# Altium project LM-008.PrjPcb
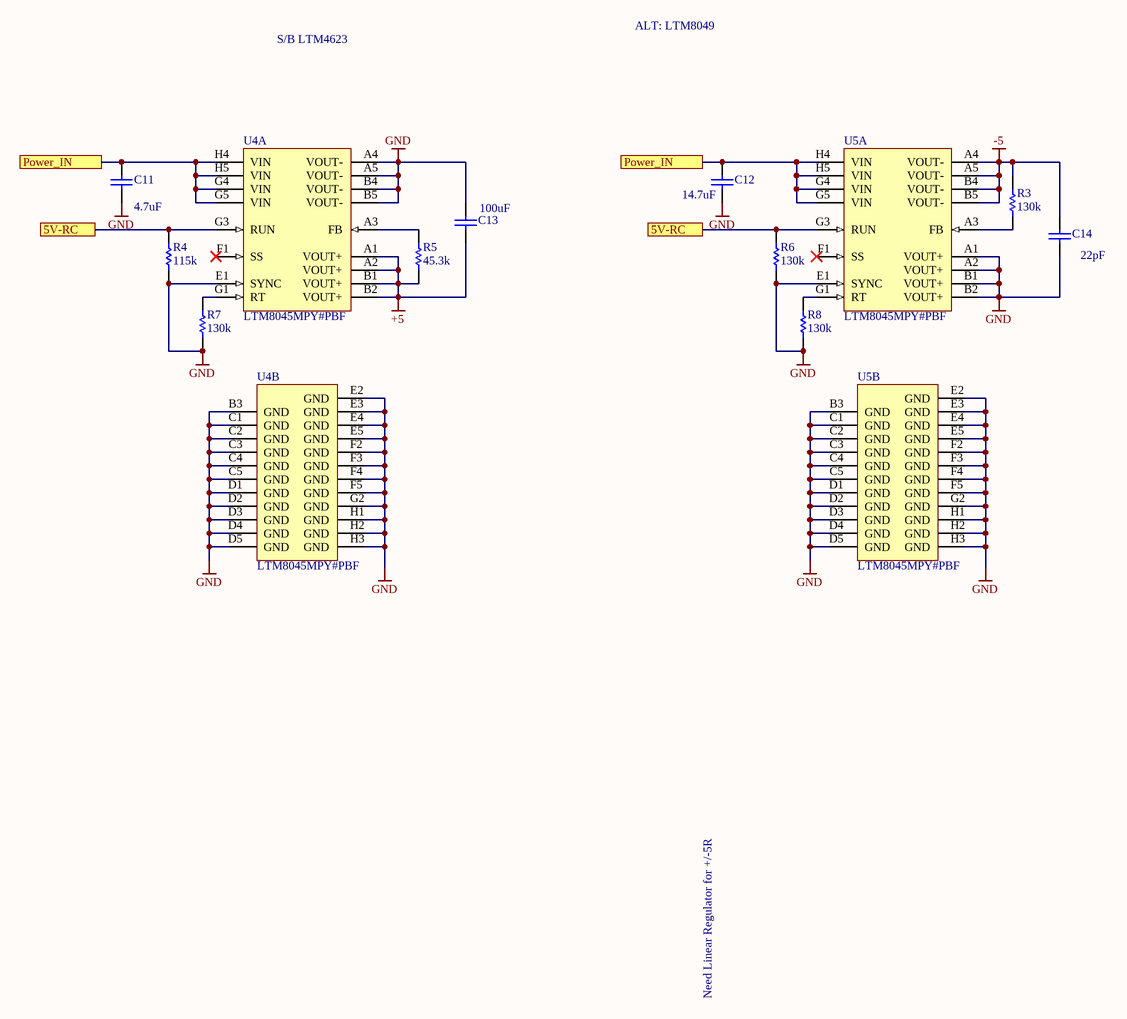
[diagram p0: 5R_Supply.SchDoc]
4 sheets, 51 parts. Net scope: flat (ports and power ports of the same name join across sheets).
Board file: LM-008.PcbDoc
Sheets:
  5R_Supply.SchDoc
  Power_Input_FET.SchDoc
  BBB-Supply.SchDoc
  ADC.SchDoc

## Sheet 5R_Supply.SchDoc
size Tabloid

### Parts
(Parts that share a designator on the sheet are numbered #1, #2 ... from top to bottom, then left to right.)
C11#1  value 4.7uF  [CAPC1206(3216)110_N]
C12  Capacitance: 14.7uF  [CAPC1206(3216)130_N]  (hidden comment: CAP CER 10UF 6.3V X5R 1206)
C13#1  value 100uF  [CAPC1210(3225)100_N]
C14#1  Capacitance: 22pF  [CAPC1206(3216)130_N]  (hidden comment: CAP CER 10UF 6.3V X5R 1206)
R3#1  Resistance (Ohms): 130k  [RESC0805(2012)_M]  (hidden comment: RES SMD 43K OHM 1% 1/8W 0805)
R4  Resistance (Ohms): 115k  [RESC0805(2012)_M]  (hidden comment: RES SMD 43K OHM 1% 1/8W 0805)
R5#1  Resistance (Ohms): 45.3k  [RESC0805(2012)_M]
R6#1  Resistance (Ohms): 130k  [RESC0805(2012)_M]  (hidden comment: RES SMD 43K OHM 1% 1/8W 0805)
R7  Resistance (Ohms): 130k  [RESC0805(2012)_M]  (hidden comment: RES SMD 43K OHM 1% 1/8W 0805)
R8  Resistance (Ohms): 130k  [RESC0805(2012)_M]  (hidden comment: RES SMD 43K OHM 1% 1/8W 0805)
U4  LTM8045MPY#PBF  [LT-BGA-40-11250X6250X4920]  (parts A,B of 2)
U5  LTM8045MPY#PBF  [LT-BGA-40-11250X6250X4920]  (parts A,B of 2)

### Ports
5V-RC, Power_IN

### Nets
+5: C13#1.1 R5#1.1 U4.A1(VOUT+) U4.A2(VOUT+) U4.B1(VOUT+) U4.B2(VOUT+)
-5: C14#1.2 R3#1.2 U5.A4(VOUT-) U5.A5(VOUT-) U5.B4(VOUT-) U5.B5(VOUT-)
GND: C11#1.1 C12.1 C13#1.2 C14#1.1 R4.1 R6#1.1 R7.1 R8.1 U4.A4(VOUT-) U4.A5(VOUT-) U4.B3(GND) U4.B4(VOUT-) U4.B5(VOUT-) U4.C1(GND) U4.C2(GND) U4.C3(GND) U4.C4(GND) U4.C5(GND) U4.D1(GND) U4.D2(GND) U4.D3(GND) U4.D4(GND) U4.D5(GND) U4.E1(SYNC) U4.E2(GND) U4.E3(GND) U4.E4(GND) U4.E5(GND) U4.F2(GND) U4.F3(GND) U4.F4(GND) U4.F5(GND) U4.G2(GND) U4.H1(GND) U4.H2(GND) U4.H3(GND) U5.A1(VOUT+) U5.A2(VOUT+) U5.B1(VOUT+) U5.B2(VOUT+) U5.B3(GND) U5.C1(GND) U5.C2(GND) U5.C3(GND) U5.C4(GND) U5.C5(GND) U5.D1(GND) U5.D2(GND) U5.D3(GND) U5.D4(GND) U5.D5(GND) U5.E1(SYNC) U5.E2(GND) U5.E3(GND) U5.E4(GND) U5.E5(GND) U5.F2(GND) U5.F3(GND) U5.F4(GND) U5.F5(GND) U5.G2(GND) U5.H1(GND) U5.H2(GND) U5.H3(GND)
Power_IN: C11#1.2 C12.2 U4.G4(VIN) U4.G5(VIN) U4.H4(VIN) U4.H5(VIN) U5.G4(VIN) U5.G5(VIN) U5.H4(VIN) U5.H5(VIN) ; port Power_IN
NetR3#1_1: R3#1.1 U5.A3(FB)
NetR4_2: R4.2 R6#1.2 U4.G3(RUN) U5.G3(RUN) ; port 5V-RC
NetR5#1_2: R5#1.2 U4.A3(FB)
NetR7_2: R7.2 U4.G1(RT)
NetR8_2: R8.2 U5.G1(RT)

Not connected (* = marked no-connect by the designer): U4 F1(SS)*; U5 F1(SS)*

### Notes on the sheet
- S/B LTM4623
- ALT: LTM8049
- Need Linear Regulator for +/-5R
- Title
- Size:
- Date:
- Tabloid
- Number:
- Time:
- Revision:
- Sheet
- of
- ZLS Corporation
- 7801 North Lamar Blvd.
- Suite E-184
- Austin, Texas 78752  USA
- (512) 453-0288
- File:

### Library data of the parts
C11#1 = CMP-1037-04332-1
C12 C14#1 = CMP-1037-04913-1: Manufacturer: Taiyo Yuden; Manufacturer Part Number: JMK316BJ106ML-T; Tolerance: ±20%; Notification: Current market demand for these product types have resulted in fluctuating and extending lead times. Lead times may differ.; Supplier 1: Digi-Key; Supplier Part Number 1: 587-5447-1-ND; RoHS: RoHS Compliant; Category: Capacitors; Stock 1: 5600; Pricing 1: 1=0.24, 10=0.161, 100=0.0817, 500=0.05592, 1000=0.04946 (USD); Packaging: Cut Tape (CT); Part Status: Active; Voltage - Rated: 6.3V; Temperature Coefficient: X5R; Operating Temperature: -55°C ~ 85°C; Features: -; Ratings: -; Applications: SMPS Filtering; Failure Rate: -; Mounting Type: Surface Mount, MLCC; Package / Case: 1206 (3216 Metric); Size / Dimension: 0.126" L x 0.063" W (3.20mm x 1.60mm); Height - Seated (Max): -; Thickness (Max): 0.071" (1.80mm); Lead Spacing: -; Lead Style: -; ComponentLink1URL: http://ds.yuden.co.jp/TYCOMPAS/ut/detail.do?productNo=JMK316BJ106ML-T&fileName=JMK316BJ106ML-T_SS&mode=specSheetDownload; ComponentLink1Description: http://ds.yuden.co.jp/TYCOMPAS/ut/detail.do?productNo=JMK316BJ106ML-T&fileName=JMK316BJ106ML-T_SS&mode=specSheetDownload
C13#1 = CMP-1038-01331-1
R3#1 R4 R6#1 R7 R8 = CMP-1013-00017-1: RES SMD 10K OHM 1% 1/8W 0805
R5#1 = CMP-1013-00017-1
U4 U5 = CMP-0483-00032-1: Inverting or SEPIC uModule DC/DC Converter with Up to 700 mA Output Current, 40-pin BGA, -55 to 125 degC, Pb-Free, Tray; Manufacturer: Linear Technology; Synchronous: no; Isupply(mA): 10; Frequency Sync Range: 200kHz - 2MHz; Number of Outputs: 1; Vin Min(V): 2.8; Switch Current(A): 3; Vin Max(V): 18; Topology: Sepic, Inverting; Extended Temp: E, I, MP; Frequency(kHz): 2000; PackageDescription: 40-Ball BGA, Body 11.25 x 6.25 mm, Pitch 1.27 mm; PartNumber: LTM8045MPY#PBF; Ishutdown(uA): 1; Frequency Adjust Range: 200kHz - 2MHz; PackageReference: BGA-40; Packing: Tray; DatasheetVersion: Rev. A; Vout Max(V): 18; ComponentLink1URL: http://www.linear.com/; Code_JEDEC: MS-028; Vswitch Max(V): 18; Tracking: no; RoHS: TRUE; Mounting Technology: Surface Mount; ComponentLink3Description: Package Specification; ComponentLink3URL: http://cds.linear.com/docs/en/packaging/BGA_40_05-08-1867.pdf; ComponentLink2Description: Datasheet; PackageVersion: Rev. Ã˜, 08/2010; ComponentLink1Description: Manufacturer URL; ComponentLink2URL: http://cds.linear.com/docs/en/datasheet/8045fa.pdf; PartId: 1

## Sheet Power_Input_FET.SchDoc: Power Input
size OrCAD A; CompanyName: ZLS; DocumentNumber: LM-008; Revision: F
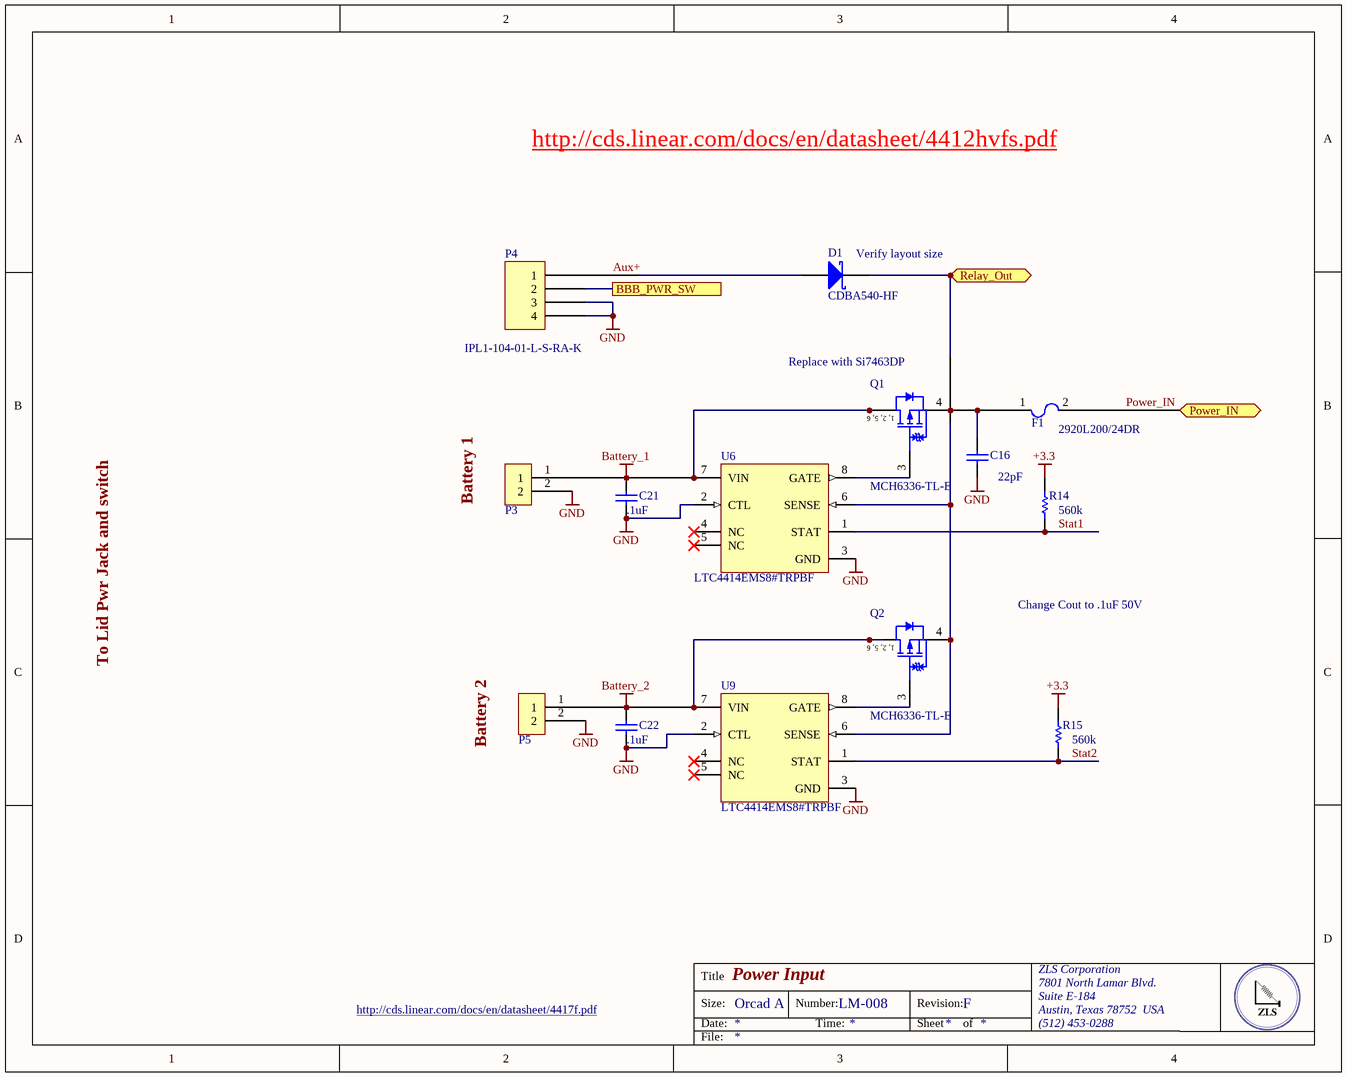
[diagram p1: Power_Input_FET.SchDoc]

### Parts
C16  Capacitance: 22pF  [CAPC1206(3216)130_N]  (hidden comment: CAP CER 10UF 6.3V X5R 1206)
C21  Capacitance: .1uF  [CAPC1206(3216)130_N]  (hidden comment: CAP CER 10UF 6.3V X5R 1206)
C22  Capacitance: .1uF  [CAPC1206(3216)130_N]  (hidden comment: CAP CER 10UF 6.3V X5R 1206)
D1  CDBA540-HF  [VISH-DO-214AC-2_M]
F1  PCT  [CAPC7451X12N]  (value not drawn)
P3  IPL1-102-01-F-S-RA-K  [IPL1-102-01-F-S-RA-K]  (value not drawn)
P4  IPL1-104-01-L-S-RA-K  [IPL1-104-01-L-S-RA-K]
P5  IPL1-102-01-F-S-RA-K  [IPL1-102-01-F-S-RA-K]  (value not drawn)
Q1  MCH6336-TL-E  [ONSC-MCPH-6_V]
Q2  MCH6336-TL-E  [ONSC-MCPH-6_V]
R14  560k  [RESC0402(1005)_L]
R15  560k  [RESC0402(1005)_L]
U6  LTC4414EMS8#TRPBF  [LT-MS8-8_L]
U9  LTC4414EMS8#TRPBF  [LT-MS8-8_L]

### Ports
BBB_PWR_SW, Power_IN, Relay_Out

### Nets
+3.3: R14.2 R15.2
Battery_1: C21.2 P3.1 Q1.1(D) Q1.2(D) Q1.5(D) Q1.6(D) U6.7(VIN)
Battery_2: C22.2 P5.1 Q2.1(D) Q2.2(D) Q2.5(D) Q2.6(D) U9.7(VIN)
GND: C16.1 C21.1 C22.1 P3.2 P4.3 P4.4 P5.2 U6.2(CTL) U6.3(GND) U9.2(CTL) U9.3(GND)
Aux+: D1.1(A) P4.1
Power_IN: F1.2 ; port Power_IN
Stat1: R14.1 U6.1(STAT)
Stat2: R15.1 U9.1(STAT)
NetC16_2: C16.2 D1.2(K) F1.1 Q1.4(S) Q2.4(S) U6.6(SENSE) U9.6(SENSE) ; port Relay_Out
NetP4_2: P4.2 ; port BBB_PWR_SW
NetQ1_3: Q1.3(G) U6.8(GATE)
NetQ2_3: Q2.3(G) U9.8(GATE)

Not connected (* = marked no-connect by the designer): U6 4(NC)* 5(NC)*; U9 4(NC)* 5(NC)*

### Notes on the sheet
- http://cds.linear.com/docs/en/datasheet/4412hvfs.pdf
- (near D1) Verify layout size
- (near Q1) Replace with Si7463DP
- (near F1) 2920L200/24DR
- Battery 1
- Change Cout to .1uF 50V
- To Lid Pwr Jack and switch
- Battery 2
- http://cds.linear.com/docs/en/datasheet/4417f.pdf
- Title
- Size:
- Date:
- Orcad A
- Number:
- Time:
- Revision:
- Sheet
- of
- ZLS Corporation
- 7801 North Lamar Blvd.
- Suite E-184
- Austin, Texas 78752  USA
- (512) 453-0288
- File:
- (in symbol CMP-1058-00598-1) 1, 2, 5, 6

### Library data of the parts
C16 C21 C22 = CMP-1037-04913-1: as C12 on sheet 5R_Supply; Supplier 1: Digi-Key; Supplier Part Number 1: 587-5447-1-ND; RoHS: RoHS Compliant; Category: Capacitors; Stock 1: 5600; Pricing 1: 1=0.24, 10=0.161, 100=0.0817, 500=0.05592, 1000=0.04946 (USD); Packaging: Cut Tape (CT); Part Status: Active; Voltage - Rated: 6.3V; Temperature Coefficient: X5R; Operating Temperature: -55°C ~ 85°C; Features: -; Ratings: -; Applications: SMPS Filtering; Failure Rate: -; Mounting Type: Surface Mount, MLCC; Package / Case: 1206 (3216 Metric); Size / Dimension: 0.126" L x 0.063" W (3.20mm x 1.60mm); Height - Seated (Max): -; Thickness (Max): 0.071" (1.80mm); Lead Spacing: -; Lead Style: -; ComponentLink1URL: http://ds.yuden.co.jp/TYCOMPAS/ut/detail.do?productNo=JMK316BJ106ML-T&fileName=JMK316BJ106ML-T_SS&mode=specSheetDownload; ComponentLink1Description: http://ds.yuden.co.jp/TYCOMPAS/ut/detail.do?productNo=JMK316BJ106ML-T&fileName=JMK316BJ106ML-T_SS&mode=specSheetDownload
D1 = D Schottky: DIODE SCHOTTKY 40V 5A DO214AB; Manufacturer: Comchip Technology; Speed: Fast Recovery =< 500ns, > 200mA (Io); Capacitance @ Vr, F: 380pF @ 4V, 1MHz; Supplier 1: Digi-Key; Supplier Part Number 1: 641-1707-6-ND; Manufacturer Part Number: CDBA540-HF; RoHS: RoHS Compliant; Category: Discrete Semiconductor Products; Stock 1: 7367; Pricing 1: 1=0.49, 10=0.381, 25=0.3208, 100=0.2612, 250=0.2164, 500=0.1791, 1000=0.13432, 2500=0.12313 (USD); Packaging: Digi-Reel®; Part Status: Active; Diode Type: Schottky; Current - Average Rectified (Io): 5A; Mounting Type: Surface Mount; Package / Case: DO-214AC, SMA; Supplier Device Package: DO-214AC (SMA); Operating Temperature - Junction: -50°C ~ 150°C; ComponentLink1URL: http://www.comchiptech.com/cms/UserFiles/CDBA540-HF%20Thru505315.%20CDBA5200-HF%20RevC.pdf; ComponentLink1Description: http://www.comchiptech.com/cms/UserFiles/CDBA540-HF%20Thru505315.%20CDBA5200-HF%20RevC.pdf
P4 = IPL1-104-01-L-S-RA-K: Manufacturer: Samtec Inc.; Connector Type: Header; Pitch - Mating: 0.100" (2.54mm); Number of Positions: 4; Number of Positions Loaded: All; Style: Board to Cable/Wire; Shrouding: Shrouded - 4 Wall; Contact Length - Mating: 0.215" (5.46mm); Contact Length - Post: 0.085" (2.16mm); Material Flammability Rating: UL94 V-0; Voltage Rating: 675VAC, 954VDC; Supplier 1: Digi-Key; Supplier Part Number 1: SAM9597-ND; Manufacturer Part Number: IPL1-104-01-L-S-RA-K; RoHS: RoHS Compliant; Category: Connectors, Interconnects; Stock 1: 265; Pricing 1: 1=2.53, 10=2.424, 100=2.02, 500=1.717, 1000=1.4645, 5000=1.313 (USD); Packaging: Tube; Part Status: Active; Contact Type: Male Pin; Number of Rows: 1; Row Spacing - Mating: -; Mounting Type: Through Hole, Right Angle; Termination: Solder; Fastening Type: Locking Ramp; Overall Contact Length: -; Insulation Height: 0.240" (6.10mm); Contact Shape: Square; Contact Finish - Mating: Gold; Contact Finish Thickness - Mating: 10µin (0.25µm); Contact Finish - Post: Tin; Contact Material: Phosphor Bronze; Insulation Material: Liquid Crystal Polymer (LCP); Features: -; Operating Temperature: -55°C ~ 125°C; Ingress Protection: -; Insulation Color: Natural; Current Rating: -; Mated Stacking Heights: -; Contact Finish Thickness - Post: -; Applications: -; ComponentLink1URL: http://suddendocs.samtec.com/prints/ipl1-1xx-xx-xxx-s-xx-x-xx-mkt.pdf; ComponentLink1Description: http://suddendocs.samtec.com/prints/ipl1-1xx-xx-xxx-s-xx-x-xx-mkt.pdf
Q1 Q2 = CMP-1058-00598-1: P-Channel Power MOSFET, -12 V, -5 A, 43 mOhm, Single, 6-Pin MCPH, Pb-Free, Tape and Reel; Manufacturer: On Semiconductor; Channel Polarity: P Channel; VGS(th) Max (V): 1.4; Ciss Typ (pF): 660; V(BR)DSS Min (V): 12; VGS Max (V): 10; Crss Typ (pF): 155; Coss Typ (pF): 210; PD Max (W): 1.5; ID Max (A): 5; Package Type: SC-88FL / MCPH-6; ComponentLink2URL: http://www.onsemi.cn/pub_link/Collateral/MCH6336-D.PDF; ComponentLink3URL: http://www.onsemi.com/pub_link/Collateral/ENA1601-D.PDF; RoHS: Pb-Free; Mounting Technology: Surface Mount; PartNumber: MCH6336-TL-E; ComponentLink2Description: Datasheet; ComponentLink1URL: http://www.onsemi.com/; ComponentLink1Description: Manufacturer URL; Configuration: Single; ComponentLink3Description: Package Specification; Packing: Tape and Reel; PackageDescription: 6-Pin Small Outline Transistor, Body 2 x 1.6 mm, Pitch 0.65 mm; PackageReference: MCPH-6
R14 R15 = CMP-1011-00927-1: Tolerance: ±1%; Temperature Coefficient: ±100ppm/°C; Supplier Part Number 1: YAG3220CT-ND; Supplier Device Package: 0402
U6 U9 = CMP-0479-00214-1: Low Loss PowerPath Controller for Large PFET, 3 to 36 V Vin, 8-pin SOP (MS8-8), -40 to 85 degC, Pb-Free, Tape and Reel; Manufacturer: Linear Technology; Ideal Diode: Single, External, P-Channel; ComponentLink3URL: http://cds.linear.com/docs/en/packaging/05081660_G_MS8.pdf; DatasheetVersion: Rev. C; ComponentLink2Description: Datasheet; ComponentLink1Description: Manufacturer URL; ComponentLink2URL: http://cds.linear.com/docs/en/datasheet/4414fc.pdf; ComponentLink3Description: Package Specification; ComponentLink1URL: http://www.linear.com/; Packing: Tape and Reel; Mounting Technology: Surface Mount; PackageDescription: 8-Pin Plastic MSOP, Body 3 x 3 mm, Pitch 0.65 mm; PackageVersion: Rev. G, 03/2012; PackageReference: MS8-8; PartNumber: LTC4414EMS8#TRPBF; RoHS: TRUE

## Sheet BBB-Supply.SchDoc
size OrCAD A
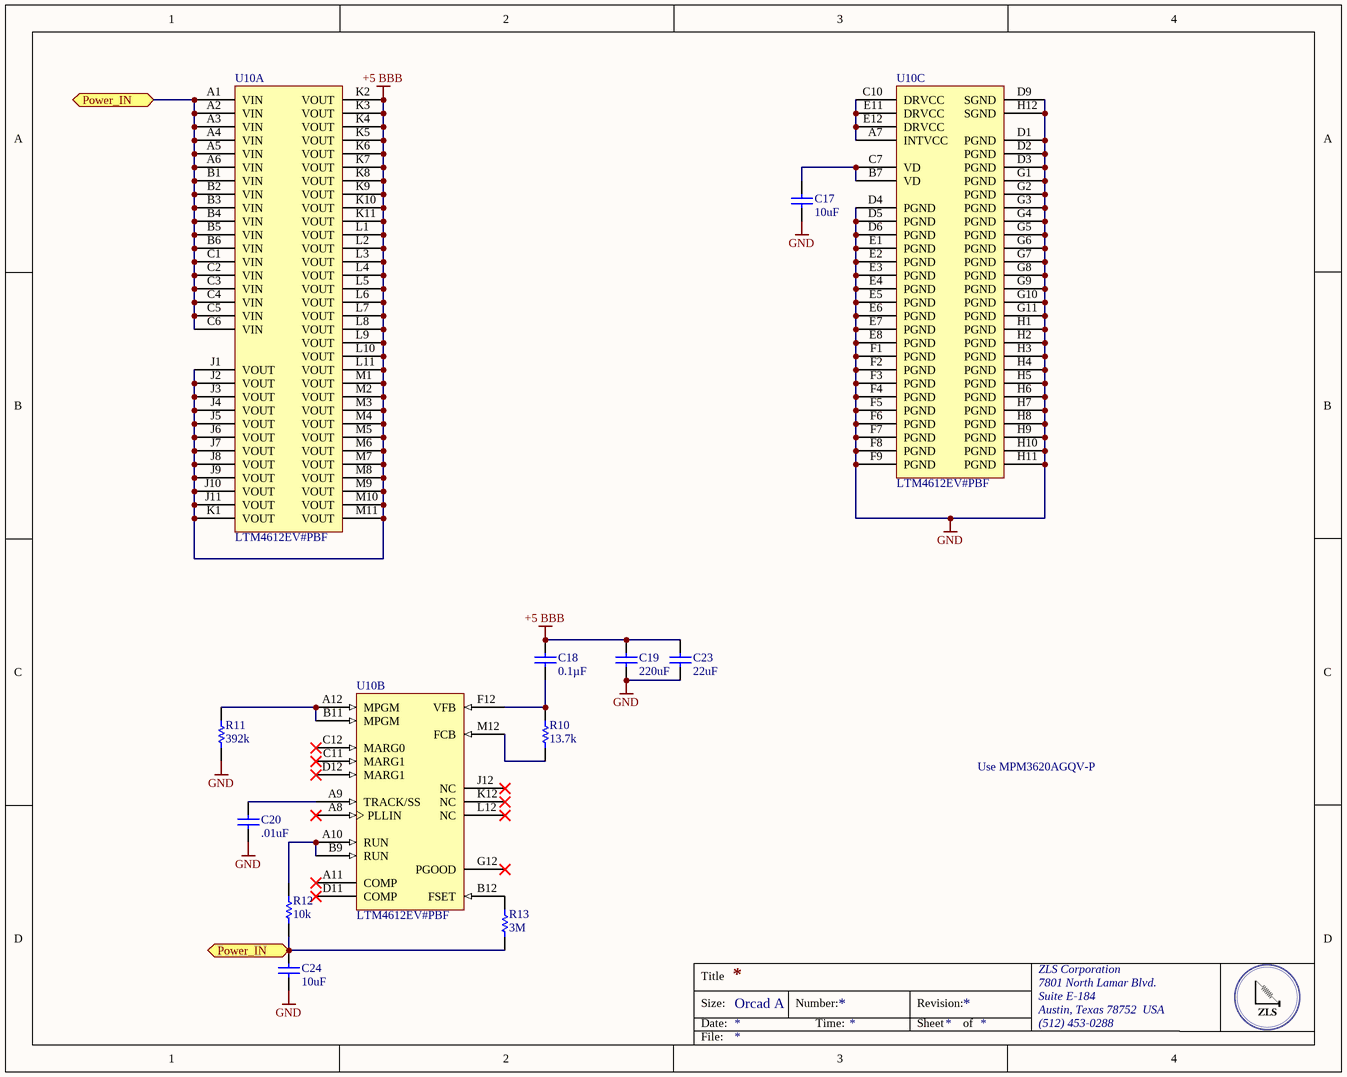
[diagram p2: BBB-Supply.SchDoc]

### Parts
(Parts that share a designator on the sheet are numbered #1, #2 ... from top to bottom, then left to right.)
C17  Capacitance: 10uF  [CAPC0805(2012)145_N]  (hidden comment: CAP CER 0.1UF 16V X7R 0805)
C18  Capacitance: 0.1µF  [CAPC0805(2012)145_N]  (hidden comment: CAP CER 0.1UF 16V X7R 0805)
C19  Capacitance: 220uF  [CAPC0805(2012)145_N]  (hidden comment: CAP CER 0.1UF 16V X7R 0805)
C20  Capacitance: .01uF  [CAPC0805(2012)145_N]  (hidden comment: CAP CER 0.1UF 16V X7R 0805)
C23  Capacitance: 22uF  [CAPC0805(2012)145_N]  (hidden comment: CAP CER 0.1UF 16V X7R 0805)
C24  Capacitance: 10uF  [CAPC0805(2012)145_N]  (hidden comment: CAP CER 0.1UF 16V X7R 0805)
R10  Resistance (Ohms): 13.7k  [RESC0805(2012)_M]  (hidden comment: RES SMD 43K OHM 1% 1/8W 0805)
R11  Resistance (Ohms): 392k  [RESC0805(2012)_M]  (hidden comment: RES SMD 43K OHM 1% 1/8W 0805)
R12  Resistance (Ohms): 10k  [RESC0805(2012)_M]  (hidden comment: RES SMD 43K OHM 1% 1/8W 0805)
R13  Resistance (Ohms): 3M  [RESC0805(2012)_M]  (hidden comment: RES SMD 43K OHM 1% 1/8W 0805)
U10#1  LTM4612EV#PBF  [LT-LGA-133-05-08-1766_V]  (parts A,B,C of 3)

### Ports
Power_IN

### Nets
+5 BBB: C18.2 C19.2 C23.2 U10#1.J1(VOUT) U10#1.J2(VOUT) U10#1.J3(VOUT) U10#1.J4(VOUT) U10#1.J5(VOUT) U10#1.J6(VOUT) U10#1.J7(VOUT) U10#1.J8(VOUT) U10#1.J9(VOUT) U10#1.J10(VOUT) U10#1.J11(VOUT) U10#1.K1(VOUT) U10#1.K2(VOUT) U10#1.K3(VOUT) U10#1.K4(VOUT) U10#1.K5(VOUT) U10#1.K6(VOUT) U10#1.K7(VOUT) U10#1.K8(VOUT) U10#1.K9(VOUT) U10#1.K10(VOUT) U10#1.K11(VOUT) U10#1.L1(VOUT) U10#1.L2(VOUT) U10#1.L3(VOUT) U10#1.L4(VOUT) U10#1.L5(VOUT) U10#1.L6(VOUT) U10#1.L7(VOUT) U10#1.L8(VOUT) U10#1.L9(VOUT) U10#1.L10(VOUT) U10#1.L11(VOUT) U10#1.M1(VOUT) U10#1.M2(VOUT) U10#1.M3(VOUT) U10#1.M4(VOUT) U10#1.M5(VOUT) U10#1.M6(VOUT) U10#1.M7(VOUT) U10#1.M8(VOUT) U10#1.M9(VOUT) U10#1.M10(VOUT) U10#1.M11(VOUT)
GND: C17.1 C19.1 C20.1 C23.1 C24.1 R11.1 U10#1.D1(PGND) U10#1.D2(PGND) U10#1.D3(PGND) U10#1.D4(PGND) U10#1.D5(PGND) U10#1.D6(PGND) U10#1.D9(SGND) U10#1.E1(PGND) U10#1.E2(PGND) U10#1.E3(PGND) U10#1.E4(PGND) U10#1.E5(PGND) U10#1.E6(PGND) U10#1.E7(PGND) U10#1.E8(PGND) U10#1.F1(PGND) U10#1.F2(PGND) U10#1.F3(PGND) U10#1.F4(PGND) U10#1.F5(PGND) U10#1.F6(PGND) U10#1.F7(PGND) U10#1.F8(PGND) U10#1.F9(PGND) U10#1.G1(PGND) U10#1.G2(PGND) U10#1.G3(PGND) U10#1.G4(PGND) U10#1.G5(PGND) U10#1.G6(PGND) U10#1.G7(PGND) U10#1.G8(PGND) U10#1.G9(PGND) U10#1.G10(PGND) U10#1.G11(PGND) U10#1.H1(PGND) U10#1.H2(PGND) U10#1.H3(PGND) U10#1.H4(PGND) U10#1.H5(PGND) U10#1.H6(PGND) U10#1.H7(PGND) U10#1.H8(PGND) U10#1.H9(PGND) U10#1.H10(PGND) U10#1.H11(PGND) U10#1.H12(SGND)
Power_IN: C24.2 R12.1 R13.1 U10#1.A1(VIN) U10#1.A2(VIN) U10#1.A3(VIN) U10#1.A4(VIN) U10#1.A5(VIN) U10#1.A6(VIN) U10#1.B1(VIN) U10#1.B2(VIN) U10#1.B3(VIN) U10#1.B4(VIN) U10#1.B5(VIN) U10#1.B6(VIN) U10#1.C1(VIN) U10#1.C2(VIN) U10#1.C3(VIN) U10#1.C4(VIN) U10#1.C5(VIN) U10#1.C6(VIN) ; port Power_IN
NetC17_2: C17.2 U10#1.B7(VD) U10#1.C7(VD)
NetC18_1: C18.1 R10.1 U10#1.F12(VFB)
NetC20_2: C20.2 U10#1.A9(TRACK/SS)
NetR10_2: R10.2 U10#1.M12(FCB)
NetR11_2: R11.2 U10#1.A12(MPGM) U10#1.B11(MPGM)
NetR12_2: R12.2 U10#1.A10(RUN) U10#1.B9(RUN)
NetR13_2: R13.2 U10#1.B12(FSET)
NetU10#1_A7: U10#1.A7(INTVCC) U10#1.C10(DRVCC) U10#1.E11(DRVCC) U10#1.E12(DRVCC)

Not connected (* = marked no-connect by the designer): U10#1 A8(PLLIN)* A11(COMP)* C11(MARG1)* C12(MARG0)* D11(COMP)* D12(MARG1)* G12(PGOOD)* J12(NC)* K12(NC)* L12(NC)*

### Notes on the sheet
- Use MPM3620AGQV-P
- Title
- Size:
- Date:
- Orcad A
- Number:
- Time:
- Revision:
- Sheet
- of
- ZLS Corporation
- 7801 North Lamar Blvd.
- Suite E-184
- Austin, Texas 78752  USA
- (512) 453-0288
- File:

### Library data of the parts
C17-C20 C23 C24 = CMP-1036-04795-1: Manufacturer: Murata Electronics North America; Manufacturer Part Number: GRM219R71C104KA01D; Tolerance: ±10%; Voltage - Rated: 25V; Supplier Part Number 1: 490-1673-6-ND; Temperature Coefficient: X7R; Thickness (Max): 0.053" (1.35mm); Supplier 2: Digi-Key; Supplier Part Number 2: 490-1683-6-ND; RoHS: RoHS Compliant; Category: Capacitors; Stock 2: 245331; Pricing 2: 1=0.14, 10=0.098, 100=0.0462, 500=0.0324, 1000=0.02683 (USD); Packaging: Digi-Reel®; Part Status: Active; Operating Temperature: -55°C ~ 125°C; Features: -; Ratings: -; Applications: General Purpose; Mounting Type: Surface Mount, MLCC; Package / Case: 0805 (2012 Metric); Size / Dimension: 0.079" L x 0.049" W (2.00mm x 1.25mm); Height - Seated (Max): -; Lead Spacing: -; Lead Style: -; ComponentLink1URL: http://www.murata.com/~/media/webrenewal/support/library/catalog/products/capacitor/mlcc/c02e.ashx; ComponentLink1Description: http://www.murata.com/~/media/webrenewal/support/library/catalog/products/capacitor/mlcc/c02e.ashx
R10-R13 = CMP-1013-00017-1: RES SMD 10K OHM 1% 1/8W 0805
U10#1 = CMP-0483-00080-1: EN55022B Compliant 36 VIN, 15 VOUT, 5 A, DC/DC uModule Regulator, 133-pin LGA, -40 to 125 degC, Pb-Free, Tray; Manufacturer: Linear Technology; Isupply(mA): 4.5; Tracking: yes; Frequency(kHz): 940; Frequency Sync Range: 200kHz - 1.3MHz; Vin Min(V): 5; Switch Current(A): 9; Vout Min(V): 3.3; Vout Max(V): 15; Number of Outputs: 1; Extended Temp: E, I, MP; Vin Max(V): 36; Ishutdown(uA): 50; Topology: Buck; Packing: Tray; PackageReference: LGA-133; ComponentLink3URL: http://cds.linear.com/docs/en/packaging/05081766_A_lga133.pdf; Code_JEDEC: MO-222; DatasheetVersion: Rev. B; PartNumber: LTM4612EV#PBF; Synchronous: yes; RoHS: TRUE; Mounting Technology: Surface Mount; ComponentLink1URL: http://www.linear.com/; ComponentLink2URL: http://cds.linear.com/docs/en/datasheet/4612fb.pdf; ComponentLink1Description: Manufacturer URL; PackageDescription: 133-Pin LGA, Body 15 x 15 mm, Pitch 1.27 mm; ComponentLink3Description: Package Specification; PackageVersion: Rev. A, 02/2013; ComponentLink2Description: Datasheet; Output Current(A): 5; PartId: 1

## Sheet ADC.SchDoc
size OrCAD A
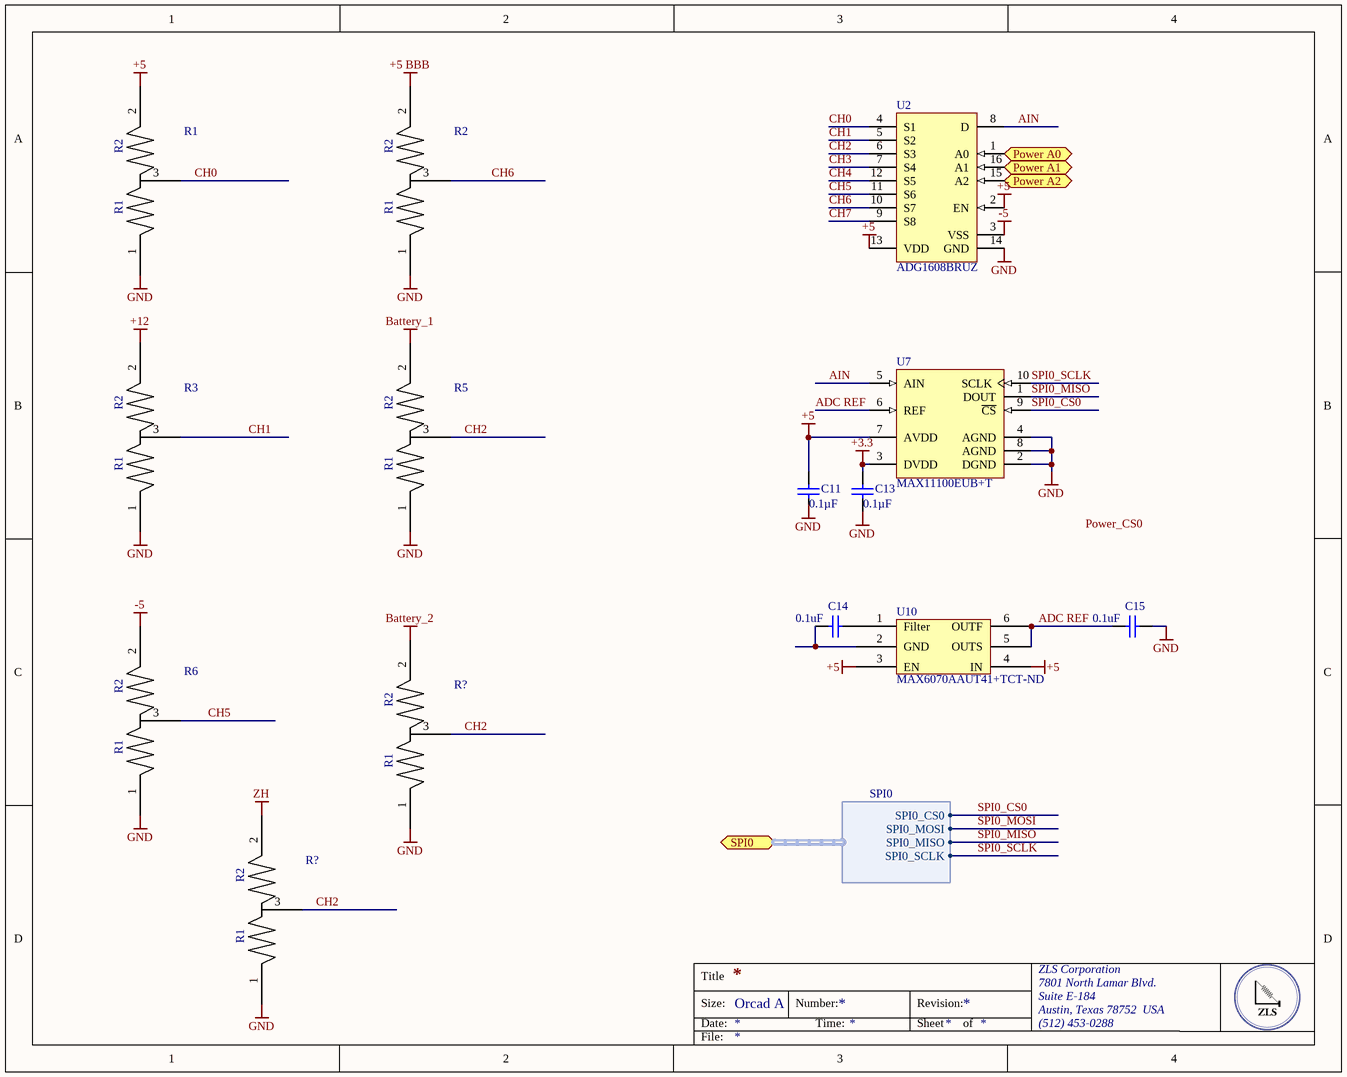
[diagram p3: ADC.SchDoc]

### Parts
(Parts that share a designator on the sheet are numbered #1, #2 ... from top to bottom, then left to right.)
C11#2  Capacitance: 0.1µF  [CAPC0805(2012)145_N]  (hidden comment: CAP CER 0.1UF 25V X7R 0805)
C13#2  Capacitance: 0.1µF  [CAPC0805(2012)145_N]  (hidden comment: CAP CER 0.1UF 25V X7R 0805)
C14#2  0.1uF  [CAPC0402(1005)60_L]
C15  0.1uF  [CAPC0402(1005)60_L]
R1  MPM  [SOT95P230X102-3N-MPM]  (value not drawn)
R2  MPM  [SOT95P230X102-3N-MPM]  (value not drawn)
R3#2  MPM  [SOT95P230X102-3N-MPM]  (value not drawn)
R5#2  MPM  [SOT95P230X102-3N-MPM]  (value not drawn)
R6#2  MPM  [SOT95P230X102-3N-MPM]  (value not drawn)
R?#1  MPM  [SOT95P230X102-3N-MPM]  (value not drawn)
R?#2  MPM  [SOT95P230X102-3N-MPM]  (value not drawn)
U2  ADG1608BRUZ  [ADI-RU-16_M]
U7  MAX11100EUB+T  [U10+2_L]
U10#2  Supplier Part Number 1: MAX6070AAUT41+TCT-ND  [SOT95P280X445-6N]  (hidden comment: MAX6070AAUT41+T)

### Ports
Power A0, Power A1, Power A2, SPI0 (harness SPI0)

### Harnesses
SPI0: SPI0_CS0, SPI0_MOSI, SPI0_MISO, SPI0_SCLK

### Nets
+3.3: C13#2.1 U7.3(DVDD)
+5: C11#2.1 R1.2 U2.2(EN) U2.13(VDD) U7.7(AVDD) U10#2.3(EN) U10#2.4(IN)
+5 BBB: R2.2
+12: R3#2.2
-5: R6#2.2 U2.3(VSS)
Battery_1: R5#2.2
Battery_2: R?#1.2
GND: C13#2.2 C15.1 R1.1 R2.1 R3#2.1 R5#2.1 R6#2.1 R?#1.1 R?#2.1 U2.14(GND) U7.2(DGND) U7.4(AGND) U7.8(AGND)
ZH: R?#2.2
ADC REF: C15.2 U7.6(REF) U10#2.5(OUTS) U10#2.6(OUTF)
AIN: U2.8(D) U7.5(AIN)
CH0: R1.3 U2.4(S1)
CH1: R3#2.3 U2.5(S2)
CH2: R5#2.3 R?#1.3 R?#2.3 U2.6(S3)
CH3: U2.7(S4)
CH4: U2.12(S5)
CH5: R6#2.3 U2.11(S6)
CH6: R2.3 U2.10(S7)
CH7: U2.9(S8)
SPI0_CS0: U7.9(~{CS}) ; port SPI0.SPI0_CS0
SPI0_MISO: U7.1(DOUT) ; port SPI0.SPI0_MISO
SPI0_MOSI: port SPI0.SPI0_MOSI
SPI0_SCLK: U7.10(SCLK) ; port SPI0.SPI0_SCLK
NetC14#2_1: C14#2.1 U10#2.1(Filter)
NetC14#2_2: C14#2.2 U10#2.2(GND)
NetU2_1: U2.1(A0) ; port Power A0
NetU2_15: U2.15(A2) ; port Power A2
NetU2_16: U2.16(A1) ; port Power A1

Not connected (* = marked no-connect by the designer): C11#2 2

### Notes on the sheet
- Labels drawn without touching a wire or pin: GND, Power_CS0
- Title
- Size:
- Date:
- Orcad A
- Number:
- Time:
- Revision:
- Sheet
- of
- ZLS Corporation
- 7801 North Lamar Blvd.
- Suite E-184
- Austin, Texas 78752  USA
- (512) 453-0288
- File:
- (in symbol MPM) R2; R1

### Library data of the parts
C11#2 C13#2 = CMP-1036-04795-1: Manufacturer: Murata Electronics North America; Manufacturer Part Number: GRM21BR71E104KA01L; Tolerance: ±10%; Supplier 1: Digi-Key; Supplier Part Number 1: 490-1673-6-ND; RoHS: RoHS Compliant; Category: Capacitors; Stock 1: 891652; Pricing 1: 1=0.2, 10=0.145, 100=0.0683, 500=0.04788, 1000=0.03964 (USD); Packaging: Digi-Reel®; Part Status: Active; Voltage - Rated: 25V; Temperature Coefficient: X7R; Operating Temperature: -55°C ~ 125°C; Features: -; Ratings: -; Applications: General Purpose; Mounting Type: Surface Mount, MLCC; Package / Case: 0805 (2012 Metric); Size / Dimension: 0.079" L x 0.049" W (2.00mm x 1.25mm); Height - Seated (Max): -; Thickness (Max): 0.053" (1.35mm); Lead Spacing: -; Lead Style: -; ComponentLink1URL: http://www.murata.com/~/media/webrenewal/support/library/catalog/products/capacitor/mlcc/c02e.ashx; ComponentLink1Description: http://www.murata.com/~/media/webrenewal/support/library/catalog/products/capacitor/mlcc/c02e.ashx
C14#2 C15 = CMP-1034-00252-1: CAP CER 0.1UF 10V X7R 0402; Manufacturer: Murata Electronics North America; Manufacturer Part Number: GRM155R71A104KA01D; Tolerance: ±10%; Supplier 1: Digi-Key; Supplier Part Number 1: 490-6321-1-ND; RoHS: RoHS Compliant; Category: Capacitors; Stock 1: 2920395; Pricing 1: 1=0.1, 10=0.014, 100=0.0063, 500=0.00446, 1000=0.00351, 2500=0.00319, 5000=0.00293 (USD); Packaging: Cut Tape (CT); Part Status: Active; Voltage - Rated: 10V; Temperature Coefficient: X7R; Operating Temperature: -55°C ~ 125°C; Features: -; Ratings: -; Applications: General Purpose; Mounting Type: Surface Mount, MLCC; Package / Case: 0402 (1005 Metric); Size / Dimension: 0.039" L x 0.020" W (1.00mm x 0.50mm); Height - Seated (Max): -; Thickness (Max): 0.022" (0.55mm); Lead Spacing: -; ComponentLink1URL: http://www.murata.com/~/media/webrenewal/support/library/catalog/products/capacitor/mlcc/c02e.ashx?la=en-us; ComponentLink1Description: http://www.murata.com/~/media/webrenewal/support/library/catalog/products/capacitor/mlcc/c02e.ashx?la=en-us
U2 = CMP-0793-00136-1: 4.5 Ohm Ron, 8-Channel +/-5 V,+12 V, +5 V and +3.3 V Multiplexer, 16-pin SOP (RU-16), Tube; Manufacturer: Analog Devices; Max Analog Signal Range: 0 to Vdd; Ron (ohms): 4.4; t transition (s): 150n; Bandwidth (Hz): 40M, 40M, 37M, 34M; Code_JEDEC: MO-153AB; PackageReference: RU-16; PackageDescription: 16-Pin Thin Shrink Small Outline Package, Body 5 x 4.4 mm, Pitch 0.65 mm; ComponentLink1Description: Manufacturer URL; ComponentLink2Description: Datasheet; PartNumber: ADG1608BRUZ; Mounting Technology: Surface Mount; PackageVersion: Nov-02; ComponentLink3Description: Package Specification; DatasheetVersion: Rev. 0; Packing: Tube; ComponentLink1URL: http://www.analog.com/en/index.html; ComponentLink3URL: http:/www.analog.com/static/imported-files/packages/36244347913743854010197452789RU16.pdf; ComponentLink2URL: http://www.analog.com/static/imported-files/data_sheets/ADG1608_1609.pdf
U7 = CMP-0249-00017-1: 16-Bit, +5V, 200ksps ADC with 10uA Shutdown, 10-Pin uMAX, -40°C to +85°C, Pb-Free, Tape and Reel; DatasheetVersion: Rev 1, Jan-2012; ComponentLink3URL: http://pdfserv.maxim-ic.com/package_dwgs/21-0061.PDF; PackageReference: U10+2; ComponentLink2URL: http://datasheets.maxim-ic.com/en/ds/MAX11100.pdf; PackageVersion: revL, 2008; ComponentLink1Description: Manufacturer URL; Code_JEDEC: MO-187-BA; ComponentLink1URL: http://www.maxim-ic.com; ComponentLink3Description: Package Specification; PackageDescription: 10-Pin Micro-MAX Thin Shrink Small Outline (uSOP), 3 x 3 x 0.85 mm Body, 0.5 mm Pitch, Pb-Free; ComponentLink2Description: Datasheet
U10#2 = MAX6070AAUT41+T: IC VREF SERIES 4.096V SOT23; Manufacturer: Maxim Integrated; Output Type: Fixed; Tolerance: ±0.04%; Temperature Coefficient: 6ppm/°C; Noise - 0.1Hz to 10Hz: 9.6µVp-p; Noise - 10Hz to 10kHz: 9µVrms; Voltage - Input: 4.3 V ~ 5.5 V; Current - Supply: 350µA; Supplier 1: Digi-Key; Manufacturer Part Number: MAX6070AAUT41+T; RoHS: RoHS Compliant; Category: Integrated Circuits (ICs); Stock 1: 2623; Pricing 1: 1=3.41, 10=3.213, 25=2.5704, 50=2.4418, 100=2.2491, 250=2.13344, 500=2.05634 (USD); Packaging: Cut Tape (CT); Part Status: Active; Reference Type: Series; Voltage - Output (Min/Fixed): 4.096V; Operating Temperature: -40°C ~ 125°C (TA); Mounting Type: Surface Mount; Package / Case: SOT-23-6; Supplier Device Package: SOT-23-6; ComponentLink1URL: https://datasheets.maximintegrated.com/en/ds/MAX6070-MAX6071.pdf; ComponentLink1Description: https://datasheets.maximintegrated.com/en/ds/MAX6070-MAX6071.pdf

## Nets that join several sheets
+3.3: Power_Input_FET (R14.2 R15.2), ADC (C13#2.1 U7.3)
+5: 5R_Supply (6 pins), ADC (7 pins)
+5 BBB: BBB-Supply (47 pins), ADC (R2.2)
-5: 5R_Supply (6 pins), ADC (R6#2.2 U2.3)
Battery_1: Power_Input_FET (7 pins), ADC (R5#2.2)
Battery_2: Power_Input_FET (7 pins), ADC (R?#1.2)
GND: 5R_Supply (64 pins), Power_Input_FET (11 pins), BBB-Supply (53 pins), ADC (13 pins)
Power_IN: 5R_Supply (10 pins), Power_Input_FET (F1.2), BBB-Supply (21 pins)